# EAGLE design Spark_Buttonsv0.2 (EAGLE 6.5.0)
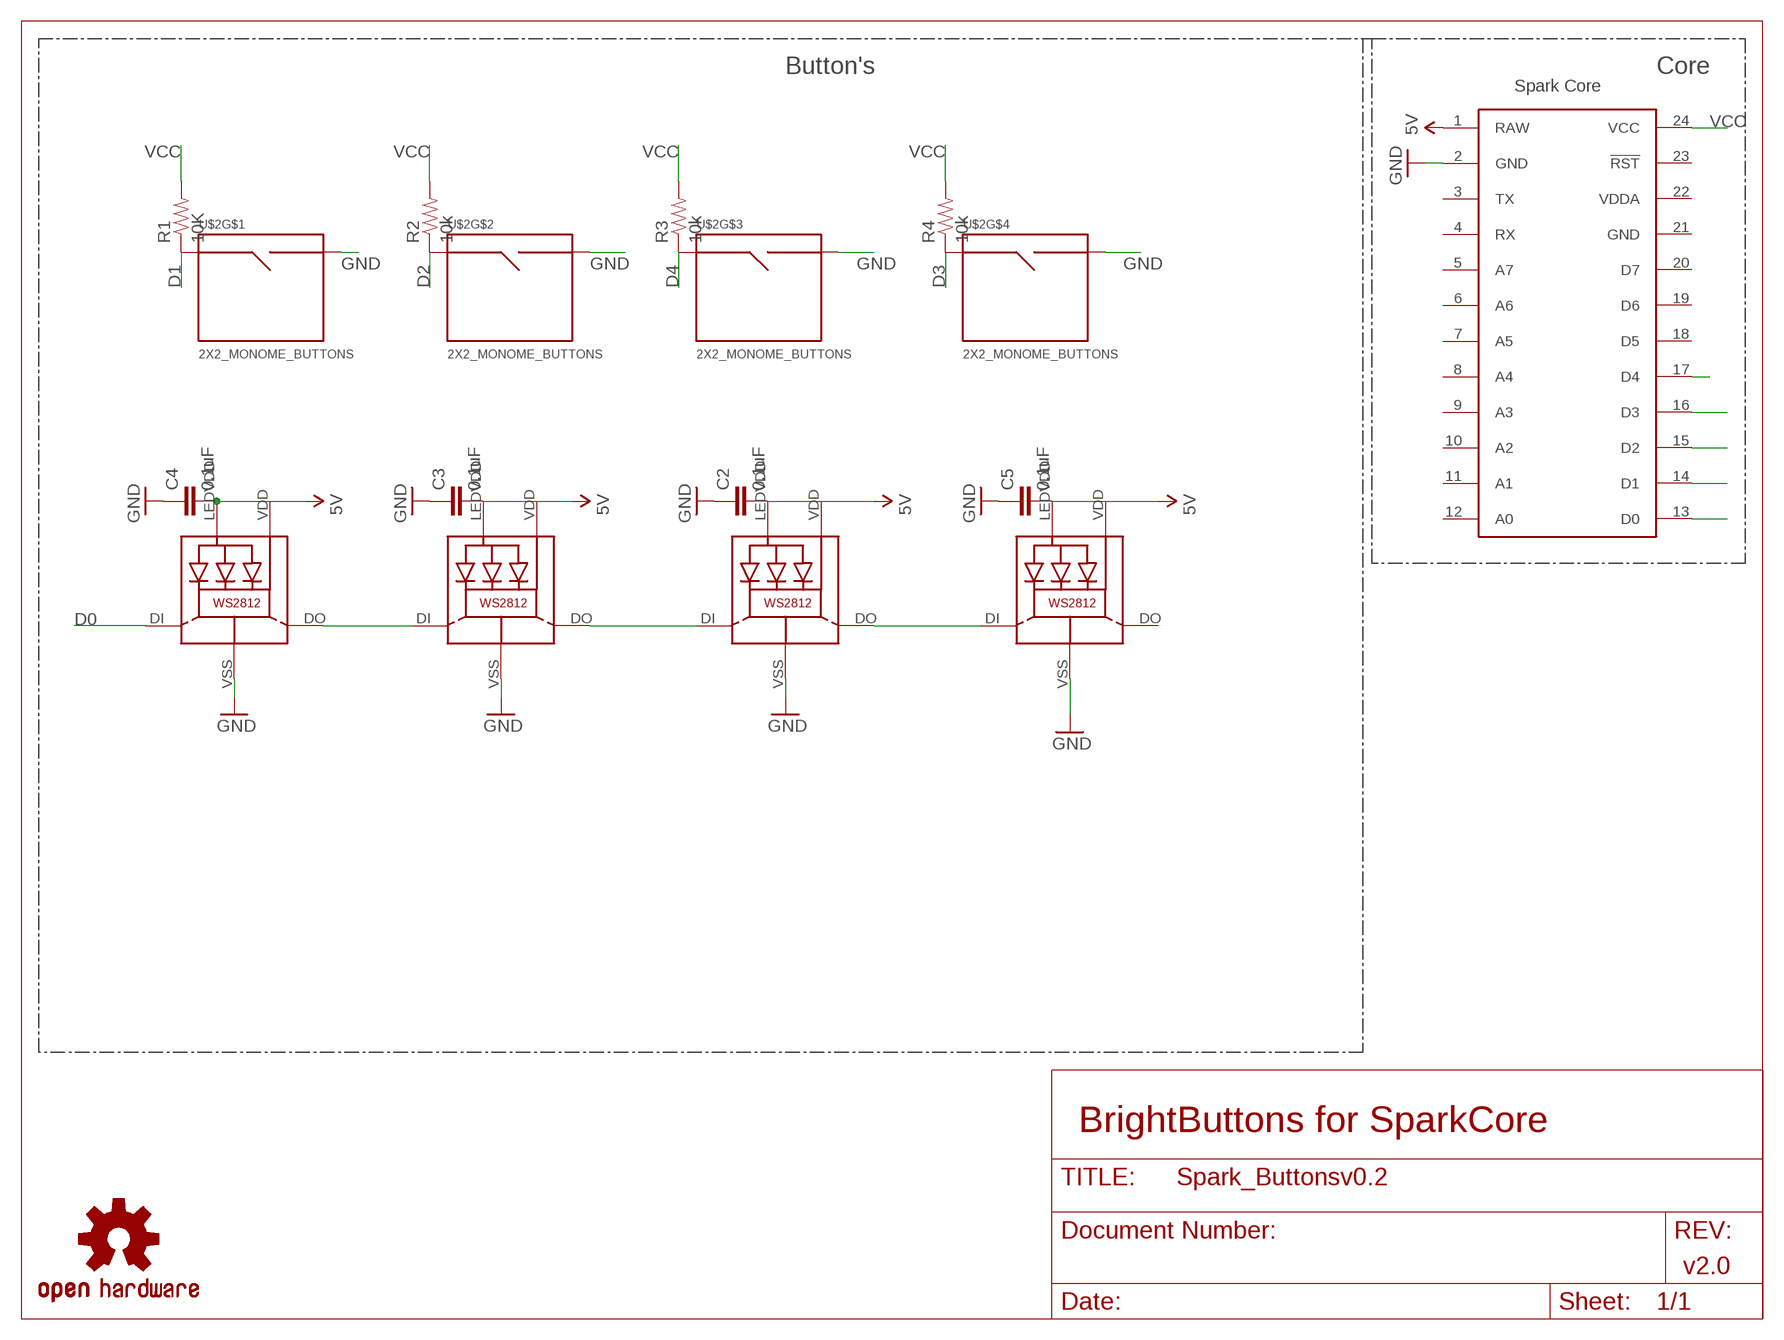
[diagram p0: schematic, sheet 1]

## Parts
C2  0.1uF  0.1UF-100V-10%(0603)  [0603-CAP]
C3  0.1uF  0.1UF-100V-10%(0603)  [0603-CAP]
C4  0.1uF  0.1UF-100V-10%(0603)  [0603-CAP]
C5  0.1uF  0.1UF-100V-10%(0603)  [0603-CAP]
LED1  WS2812  [WS2812]
LED2  WS2812  [WS2812]
LED3  WS2812  [WS2812]
LED4  WS2812  [WS2812]
LOGO1  OSHW-LOGOM  [OSHW-LOGO-M]
R1  10K  2.2KOHM1/10W1%(0603)  [0603-RES]
R2  10k  2.2KOHM1/10W1%(0603)  [0603-RES]
R3  10k  2.2KOHM1/10W1%(0603)  [0603-RES]
R4  10k  2.2KOHM1/10W1%(0603)  [0603-RES]
U$1  SPARK_CORECORE  [SPARK_CORE]
U$2  2X2_MONOME_BUTTONS  [2X2_MONOME_PAD]

## Nets
5V: C2.2 C3.2 C4.2 C5.2 LED1.LEDVDD LED1.VDD LED2.LEDVDD LED2.VDD LED3.LEDVDD LED3.VDD LED4.LEDVDD LED4.VDD U$1.1(RAW)
D0: LED1.DI U$1.13(D0)
D1: R1.1 U$1.14(D1) U$2.SIG1
D2: R2.1 U$1.15(D2) U$2.SIG3(SIG1)
D3: R4.1 U$1.16(D3) U$2.SIG7(SIG1)
D4: R3.1 U$1.17(D4) U$2.SIG5(SIG1)
GND: C2.1 C3.1 C4.1 C5.1 LED1.VSS(GND) LED2.VSS(GND) LED3.VSS(GND) LED4.VSS(GND) U$1.2(GND) U$2.SIG2 U$2.SIG4(SIG2) U$2.SIG6(SIG2) U$2.SIG8(SIG2)
N$1: LED1.DO LED2.DI
N$2: LED2.DO LED3.DI
N$3: LED3.DO LED4.DI
VCC: R1.2 R2.2 R3.2 R4.2 U$1.24(VCC)
Unconnected: LED4.DO U$1.3(TX) U$1.4(RX) U$1.5(A7) U$1.6(A6) U$1.7(A5) U$1.8(A4) U$1.9(A3) U$1.10(A2) U$1.11(A1) U$1.12(A0) U$1.18(D5) U$1.19(D6) U$1.20(D7) U$1.23(!RST)

## Notes on the sheet
- Button's | Core
- Spark Core
- BrightButtons for SparkCore
- v2.0

## Power pins joined to a net without a drawn wire
GND: U$1.21(GND)
VDDA: U$1.22(VDDA)

## Library data of the parts
C2-C5 = SparkFun-Capacitors:0.1UF-100V-10%(0603): CAP-08390; PROD_ID: CAP-08390
LED1-LED4 = adafruit:WS2812
LOGO1 = Spark:OSHW-LOGO: Open Source Hardware Logo This logo indicates the piece of hardware it is found on incorporates a OSHW license and/or adheres to the definition of open source hardware found here: http://freedomdefined.org/OSHW
R1-R4 = SparkFun-Resistors:2.2KOHM1/10W1%(0603): RES-08272; PROD_ID: RES-08272; VALUE: 2.2k
U$1 = Spark:SPARK_CORE
U$2 = OmaticEagleParts:2X2_MONOME_BUTTONS

## Board
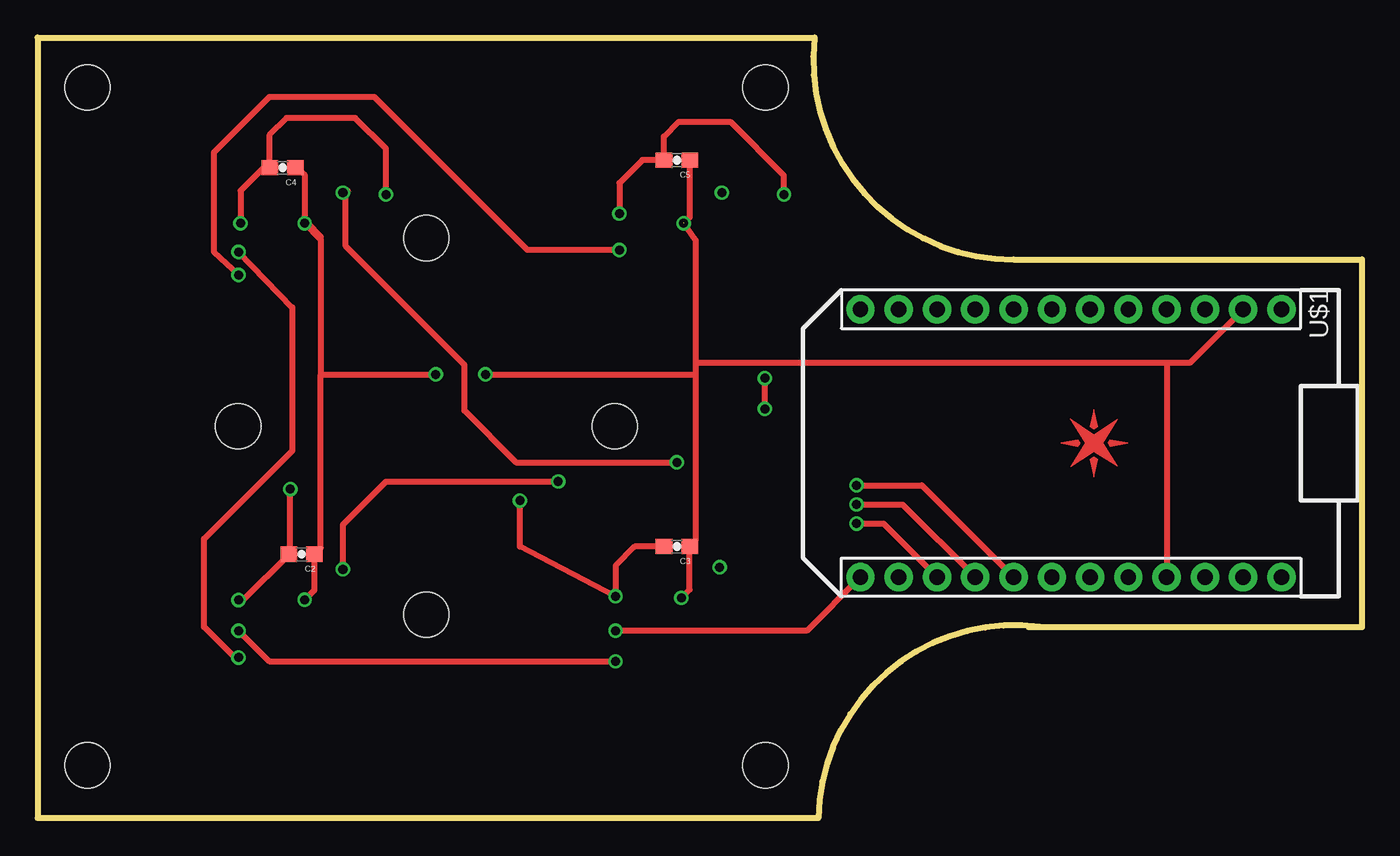
[diagram p1: board, top side]
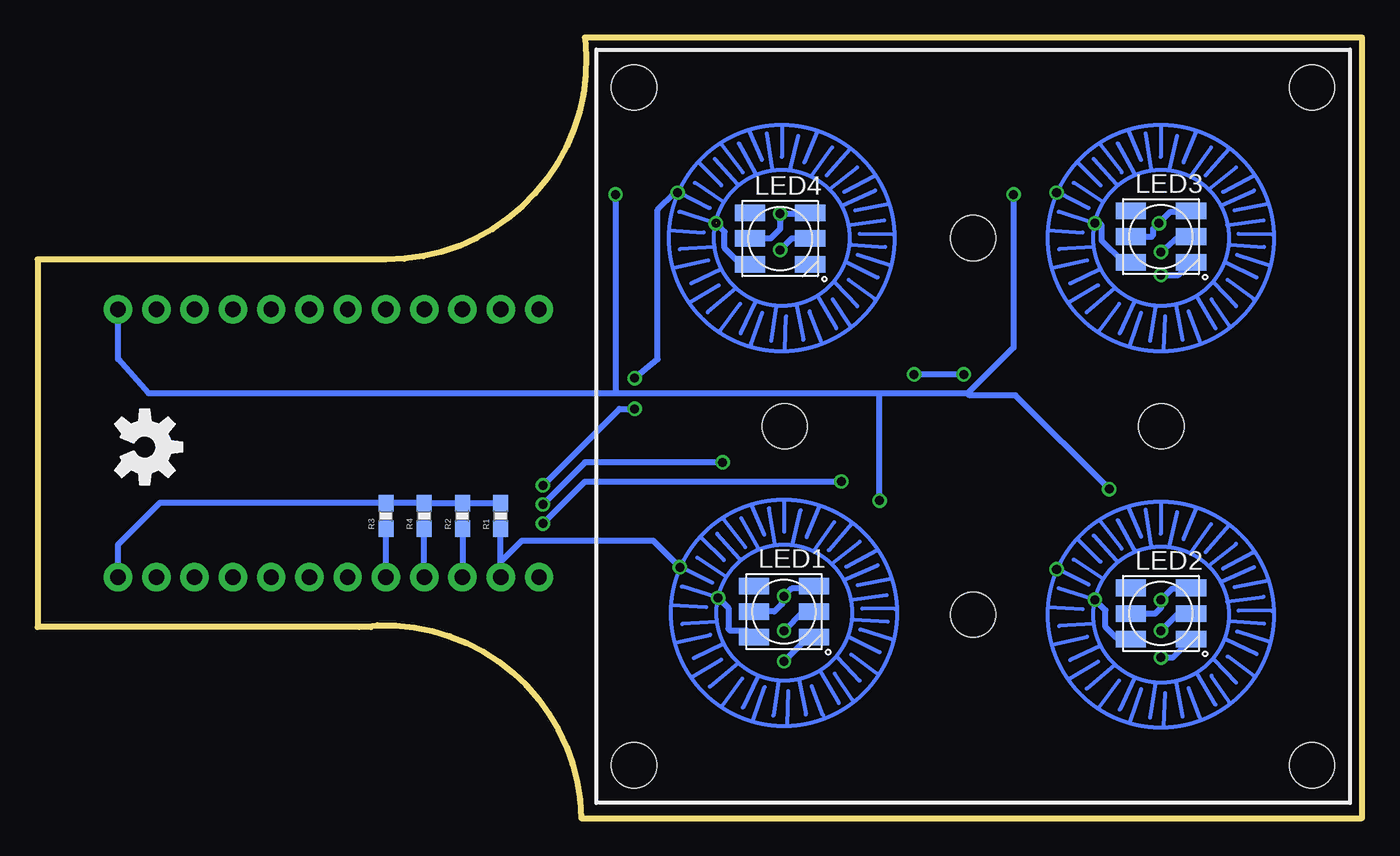
[diagram p2: board, bottom side, seen from below]

Size 87.88 x 51.82 mm. Coordinates in mm from the lower left corner, seen from the top.
Outline: 66.55,12.7 arc97 51.82,0 0,0 0,51.82 51.56,51.82 arc97 64.77,37.08 87.88,37.08 87.88,12.7 65.79,12.7
Copper layers (1*16): Top 0.0356mm / dielectric 1.5011mm / Bottom 0.0356mm
Design rules "LaenPCBOrder *": minimum track width 6mil, minimum drill 13mil, track to track 6mil, track to pad 6mil, pad to pad 6mil, via to via 6mil, smd to smd 6mil, copper to edge 15mil, drill to drill 6mil, minimum pad ring 7mil, minimum via ring 7mil, stop-mask expansion 4mil, vias tented up to drill 30mil, thermal gap 10mil

### Footprints (pad centres in the part's own frame; a part is rotated, then mirrored left to right if it is on the bottom)
0603-CAP = smd 1.1 x 1: 1 -0.85,0; 2 0.85,0
WS2812 = smd 2 x 1.1: DI 2,0; DO 2,-1.7; LEDVDD -2,0; NC -2,1.7; VDD 2,1.7; VSS -2,-1.7
0603-RES = smd 1.1 x 1: 1 -0.85,0; 2 0.85,0
SPARK_CORE = drill 1.016 pad 1.88: 1 -8.89,13.97; 2 -8.89,11.43; 3 -8.89,8.89; 4 -8.89,6.35; 5 -8.89,3.81; 6 -8.89,1.27; 7 -8.89,-1.27; 8 -8.89,-3.81; 9 -8.89,-6.35; 10 -8.89,-8.89; 11 -8.89,-11.43; 12 -8.89,-13.97; 13 8.89,-13.97; 14 8.89,-11.43; 15 8.89,-8.89; 16 8.89,-6.35; 17 8.89,-3.81; 18 8.89,-1.27; 19 8.89,1.27; 20 8.89,3.81; 21 8.89,6.35; 22 8.89,8.89; 23 8.89,11.43; 24 8.89,13.97
2X2_MONOME_PAD = drill 0.6: SIG1 -19.858,-9.76; SIG2 -17.318,-11.792; SIG3 5.142,-9.887; SIG4 7.682,-11.919; SIG5 -20.012,15.113; SIG6 -17.472,13.081; SIG7 5.142,15.113; SIG8 7.682,13.081 | hole 3: -12.9,-0.4; -0.4,12.1; 12.1,-0.4; -0.4,-12.9; -22.9,-22.9; -22.9,22.1; 22.1,22.1; 22.1,-22.9

### Placement (x,y rotation side)
C2  17.53,17.53 180 top
C3  42.42,18.03 180 top
C4  16.26,43.18 180 top
C5  42.42,43.69 180 top
E$1  [SPARK_LOGO_PLUS_PLANE]  70.1,24.89 180 top
LED1  38.35,13.72 0 bottom
LED2  13.34,13.59 0 bottom
LED3  13.34,38.61 0 bottom
LED4  38.61,38.48 0 bottom
LOGO1  80.77,24.64 270 bottom
R1  57.15,20.07 90 bottom
R2  59.69,20.07 90 bottom
R3  64.77,20.07 90 bottom
R4  62.23,20.07 90 bottom
U$1  68.58,24.89 270 top
U$2  25.4,26.42 0 bottom

### Tracks (layer width: path | path; a pad name or v marks a point on that pad's centre or on a via)
5V  (via drill 0.6)
  Top 0.406: v13.46,39.5 13.46,41.66 14.99,43.18 C4.2 15.41,45.38 16.51,46.48 21.08,46.48 23.11,44.45 v23.11,41.4 | v16.76,21.84 16.76,17.61 C2.2 13.63,14.48 v13.34,14.48 | v32,21.08 32,18.03 v38.35,14.73 38.35,16.76 39.62,18.03 C3.2 | v38.61,40.13 38.61,42.16 40.13,43.69 C5.2 41.57,45.25 42.55,46.23 45.97,46.23 49.53,42.67 v49.53,41.4
  Bottom 0.406: v49.53,41.4 49.53,28.19 | 49.53,28.19 80.52,28.19 82.55,30.48 U$1.1 | v23.11,41.4 23.11,31.24 26.16,28.19 | 26.16,28.19 32,28.19 | 32,28.19 49.53,28.19 | 15.49,38.61 LED3.LEDVDD 13.97,38.61 13.84,38.73 13.84,39.12 v13.46,39.5 12.7,40.26 11.38,40.26 LED3.VDD 11.61,40.31 11.68,40.39 | 26.16,28.19 26.03,28.07 22.99,28.07 v16.76,21.84 | 11.64,15.24 LED2.VDD 11.89,15.29 11.94,15.24 12.57,15.24 v13.34,14.48 13.34,13.97 13.72,13.59 LED2.LEDVDD | v32,21.08 32,28.19 | LED1.VDD 36.53,15.24 37.85,15.24 v38.35,14.73 38.48,14.61 38.48,14.22 38.99,13.72 LED1.LEDVDD | LED4.VDD 36.66,40.13 v38.61,40.13 38.61,39.12 39.24,38.48 LED4.LEDVDD
D0  (via drill 0.6)
  Top 0.406: U$1.13 51.05,12.45 v38.35,12.45
  Bottom 0.406: v38.35,12.45 37.08,13.72 LED1.DI
D1
  Bottom 0.406: R1.1 U$1.14 57.15,17.02 55.75,18.42 47.02,18.42 U$2.SIG1
D2  (via drill 0.6)
  Top 0.406: U$2.SIG3 20.26,19.5 23.11,22.35 v34.54,22.35 | v54.36,19.56 56.13,19.56 U$1.15
  Bottom 0.406: v54.36,19.56 51.56,22.35 v34.54,22.35 | R2.1 U$1.15
D3  (via drill 0.6)
  Top 0.406: 20.57,41.66 U$2.SIG7 20.45,41.34 20.45,37.97 28.32,30.1 28.32,27.05 31.75,23.62 v42.42,23.62 | v54.36,20.83 57.4,20.83 U$1.16
  Bottom 0.406: v42.42,23.62 51.56,23.62 v54.36,20.83 | U$1.16 R4.1
D4  (via drill 0.6)
  Top 0.406: v48.26,27.18 v48.26,29.21 | v54.36,22.1 58.67,22.1 U$1.17
  Bottom 0.406: v54.36,22.1 49.28,27.18 v48.26,27.18 | v48.26,29.21 46.74,30.48 46.74,40.39 45.59,41.53 U$2.SIG5 | U$1.17 R3.1
GND  (via drill 0.6)  (1 unrouted)
  Top 0.406: C4.1 17.27,43.18 17.72,42.73 U$2.SIG8 | U$2.SIG4 18.38,15.15 C2.1 18.8,17.95 18.8,29.46 | U$2.SIG2 43.27,15.17 C3.1 43.69,18.45 43.69,29.46 | 43.69,29.46 43.69,30.23 | 43.69,30.23 43.69,38.35 42.87,39.55 | 74.93,30.23 43.69,30.23 | 74.93,30.23 U$1.21 | U$1.2 76.45,30.23 74.93,30.23 | 18.8,38.42 18.8,38.61 17.91,39.5 U$2.SIG8 | U$2.SIG8 18.8,38.42 | 18.8,38.42 18.8,29.46 | 18.8,29.46 v26.42,29.46 | C5.1 43.27,39.89 U$2.SIG6 | v29.72,29.46 43.69,29.46
  Bottom 0.406: LED2.VSS 16.33,12.02 17.02,12.7 17.02,13.8 U$2.SIG4 | LED1.VSS 40.78,12.45 41.91,12.45 42.04,12.57 42.04,13.97 42.69,14.62 U$2.SIG2 | v26.42,29.46 v29.72,29.46 | LED4.VSS 40.78,36.96 41.4,36.96 42.29,37.85 42.29,38.92 U$2.SIG6 | U$2.SIG8 17.4,39.5 17.27,39.37 17.27,38.35 15.88,36.96 15.38,36.96 LED3.VSS
N$1  (via drill 0.6)
  Top 0.406: v13.34,12.45 15.37,10.41 v38.35,10.41
  Bottom 0.406: v13.34,12.45 12.19,13.59 LED2.DI | LED1.DO 36.75,12.02 v38.35,10.41
N$2  (via drill 0.6)
  Top 0.406: v13.34,37.59 16.89,33.91 16.89,24.38 11.05,18.54 11.05,12.7 13.08,10.67 v13.34,10.67
  Bottom 0.406: LED3.DI 12.19,38.61 v13.34,37.59 | v13.34,10.67 12.56,10.67 LED2.DO
N$3  (via drill 0.6)
  Top 0.406: v38.61,37.72 32.51,37.72 22.35,47.88 15.37,47.88 11.68,44.2 11.68,37.59 v13.34,36.07
  Bottom 0.406: LED4.DI 37.85,38.48 v38.61,37.72 | v13.34,36.07 12.18,36.07 LED3.DO
VCC
  Bottom 0.406: R1.2 R2.2 R4.2 R3.2 64.81,20.96 79.76,20.96 82.55,18.16 U$1.24